# Altium schematic sheet USB_UART_PSU_SCH.SchDoc
size A4
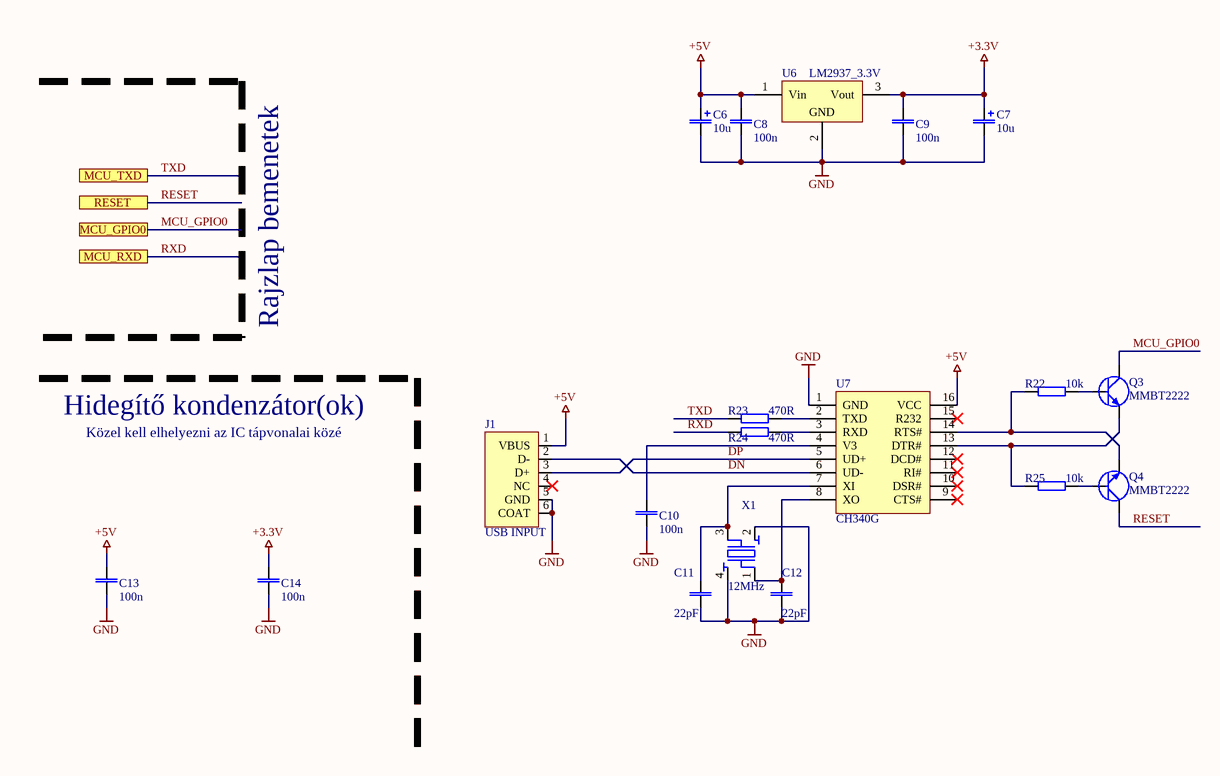
[diagram p0: USB_UART_PSU_SCH.SchDoc]

## Parts
C6  10u  [CAP 1210]
C7  10u  [CAP 1210]
C8  100n  [CAP 0805]
C9  100n  [CAP 0805]
C10  100n  [CAP 0805]
C11  22pF  [CAP 0805]
C12  22pF  [CAP 0805]
C13  100n  [CAP 0805]
C14  100n  [CAP 0805]
J1  USB INPUT  [MUSB-B2.0S05PFHSB-T]
Q3  MMBT2222  [SOT23]
Q4  MMBT2222  [SOT23]
R22  10k  [RES 0805]
R23  470R  [RES 0805]
R24  470R  [RES 0805]
R25  10k  [RES 0805]
U6  LM2937_3.3V  [SOT223]
U7  CH340G  [SO16]
X1  12MHz  [SMD_QUARTZ]

## Ports
MCU_GPIO0, MCU_RXD, MCU_TXD, RESET

## Nets
+3.3V: C7.1(+) C9.2 C14.2 U6.3(Vout)
+5V: C6.1(+) C8.2 C13.2 J1.1(VBUS) U6.1(Vin) U7.16(VCC)
GND: C6.2(-) C7.2(-) C8.1 C9.1 C10.2 C11.2 C12.2 C13.1 C14.1 J1.5(GND) J1.6(COAT) U6.2(GND) U7.1(GND) X1.2(GND) X1.4(GND)
DN: J1.2(D-) U7.6(UD-)
DP: J1.3(D+) U7.5(UD+)
MCU_GPIO0: Q3.3(C) ; port MCU_GPIO0
RESET: Q4.3(C) ; port RESET
RXD: R24.1 ; port MCU_RXD
TXD: R23.1 ; port MCU_TXD
NetC10_1: C10.1 U7.4(V3)
NetC11_1: C11.1 U7.7(XI) X1.3
NetC12_1: C12.1 U7.8(XO) X1.1
NetQ3_1: Q3.1(B) R22.2
NetQ3_2: Q3.2(E) R25.1 U7.13(DTR#)
NetQ4_1: Q4.1(B) R25.2
NetQ4_2: Q4.2(E) R22.1 U7.14(RTS#)
NetR23_2: R23.2 U7.2(TXD)
NetR24_2: R24.2 U7.3(RXD)

Not connected (* = marked no-connect by the designer): J1 4(NC)*; U7 9(CTS#)* 10(DSR#)* 11(RI#)* 12(DCD#)* 15(R232)*

## Notes on the sheet
- Rajzlap bemenetek
- Hidegítő kondenzátor(ok)
- Közel kell elhelyezni az IC tápvonalai közé

## Library data of the parts
C6 C7 = CAP_POL: POLARIZED CAPACITOR; Reference: 92-01-83; Supplier: Lomex; VALUE: 10u
C8-C14 = CAP: NON POLARIZED CAPACITOR; Supplier: Lomex
  C8-C10 C13 C14: VALUE: 100n; Reference: 82-10-76
  C11 C12: VALUE: 22pF; Reference: 82-09-18
J1 = USB_5PIN: 5PIN miniUSB SMD connector; Supplier: Lomex; Reference: 43-28-33; VALUE: USB INPUT
Q3 Q4 = MMBT2222: NPN transistor, SO23; Value: MMBT2222; Supplier: Lomex; Reference: 86-00-73
R22-R25 = RES: RESISTOR; Supplier: Lomex
  R22 R25: Reference: 81-10-99; VALUE: 10k
  R23 R24: Reference: 81-10-83; VALUE: 470R
U6 = LM2937: SOT223; Reference: *; Supplier: *; VALUE: LM2937_3.3V
U7 = CH340G: USB to UART; Reference: *; VALUE: CH340G; Supplier: *
X1 = QUARTZ: QUARTZ CRYSTAL; VALUE: 12MHz; Supplier: Lomex; Reference: 40-02-17